# Altium project BMS Top Cell.PrjPcb
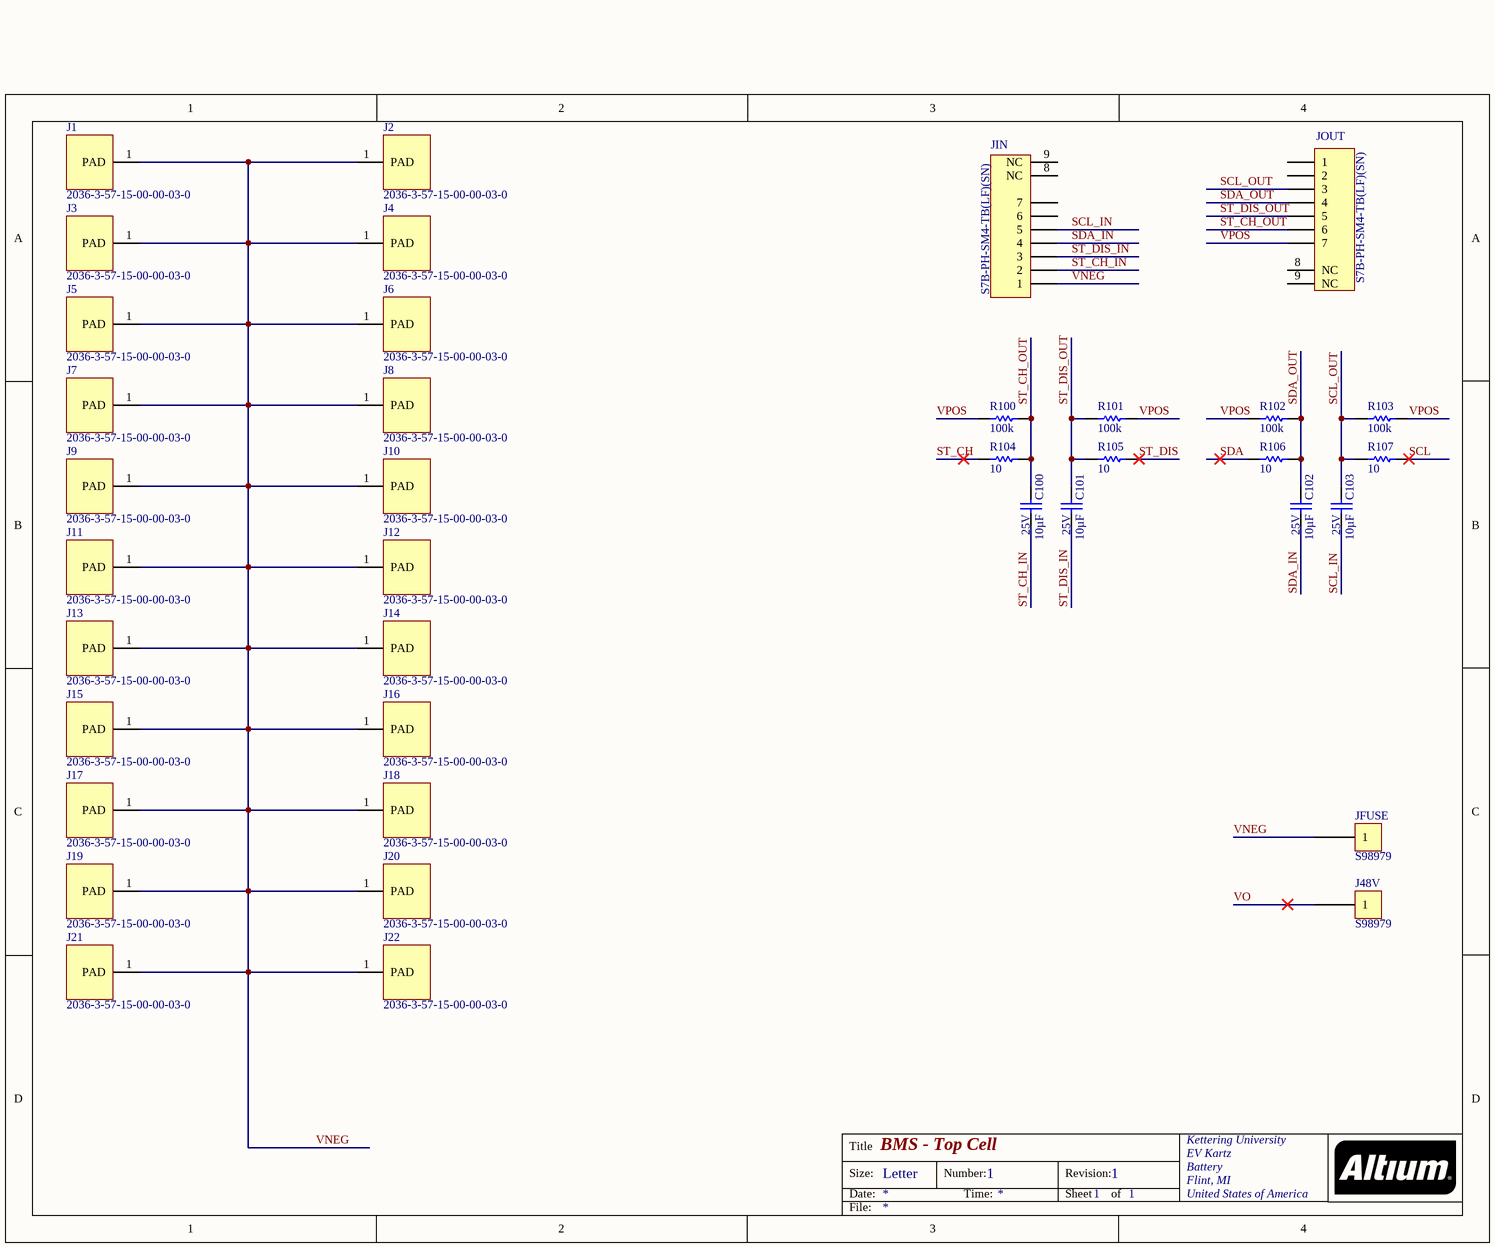
[diagram p0: Pg1 Top Sheet and Micro.SchDoc]
1 sheet, 38 parts. Net scope: global (net labels, ports and power ports of the same name join across sheets).
Board file: Top_Cell.PcbDoc

## Sheet Pg1 Top Sheet and Micro.SchDoc: BMS - Top Cell
size Letter; Organization: Kettering University; Address1: EV Kartz; Address2: Battery; Address3: Flint, MI; Address4: United States of America; DocumentNumber: 1; Revision: 1; SheetNumber: 1; SheetTotal: 1

### Parts
C100  value 10µF  Rated: 25V  [CAPC3225N]  (hidden comment: C1210C106K3RACAUTO)
C101  value 10µF  Rated: 25V  [CAPC3225N]  (hidden comment: C1210C106K3RACAUTO)
C102  value 10µF  Rated: 25V  [CAPC3225N]  (hidden comment: C1210C106K3RACAUTO)
C103  value 10µF  Rated: 25V  [CAPC3225N]  (hidden comment: C1210C106K3RACAUTO)
J1  2036-3-57-15-00-00-03-0  [6mm Pad]
J2  2036-3-57-15-00-00-03-0  [6mm Pad]
J3  2036-3-57-15-00-00-03-0  [6mm Pad]
J4  2036-3-57-15-00-00-03-0  [6mm Pad]
J5  2036-3-57-15-00-00-03-0  [6mm Pad]
J6  2036-3-57-15-00-00-03-0  [6mm Pad]
J7  2036-3-57-15-00-00-03-0  [6mm Pad]
J8  2036-3-57-15-00-00-03-0  [6mm Pad]
J9  2036-3-57-15-00-00-03-0  [6mm Pad]
J10  2036-3-57-15-00-00-03-0  [6mm Pad]
J11  2036-3-57-15-00-00-03-0  [6mm Pad]
J12  2036-3-57-15-00-00-03-0  [6mm Pad]
J13  2036-3-57-15-00-00-03-0  [6mm Pad]
J14  2036-3-57-15-00-00-03-0  [6mm Pad]
J15  2036-3-57-15-00-00-03-0  [6mm Pad]
J16  2036-3-57-15-00-00-03-0  [6mm Pad]
J17  2036-3-57-15-00-00-03-0  [6mm Pad]
J18  2036-3-57-15-00-00-03-0  [6mm Pad]
J19  2036-3-57-15-00-00-03-0  [6mm Pad]
J20  2036-3-57-15-00-00-03-0  [6mm Pad]
J21  2036-3-57-15-00-00-03-0  [6mm Pad]
J22  2036-3-57-15-00-00-03-0  [6mm Pad]
J48V  S98979  [S98979]
JFUSE  S98979  [S98979]
JIN  S7B-PH-SM4-TB(LF)(SN)  [JST-PH-S7]
JOUT  S7B-PH-SM4-TB(LF)(SN)  [JST-PH-S7]
R100  value 100k  [RESC2012N]  (hidden comment: ERJ-6ENF1003V)
R101  value 100k  [RESC2012N]  (hidden comment: ERJ-6ENF1003V)
R102  value 100k  [RESC2012N]  (hidden comment: ERJ-6ENF1003V)
R103  value 100k  [RESC2012N]  (hidden comment: ERJ-6ENF1003V)
R104  value 10  [RESC2012N]  (hidden comment: ERJ-6ENF10R0V)
R105  value 10  [RESC2012N]  (hidden comment: ERJ-6ENF10R0V)
R106  value 10  [RESC2012N]  (hidden comment: ERJ-6ENF10R0V)
R107  value 10  [RESC2012N]  (hidden comment: ERJ-6ENF10R0V)

### Nets
SCL: R107.2
SCL_IN: C103.1 JIN.5
SCL_OUT: C103.2 JOUT.3 R103.2 R107.1
SDA: R106.1
SDA_IN: C102.1 JIN.4
SDA_OUT: C102.2 JOUT.4 R102.1 R106.2
ST_CH: R104.1
ST_CH_IN: C100.1 JIN.2
ST_CH_OUT: C100.2 JOUT.6 R100.1 R104.2
ST_DIS: R105.2
ST_DIS_IN: C101.1 JIN.3
ST_DIS_OUT: C101.2 JOUT.5 R101.2 R105.1
VNEG: J1.1(PAD) J2.1(PAD) J3.1(PAD) J4.1(PAD) J5.1(PAD) J6.1(PAD) J7.1(PAD) J8.1(PAD) J9.1(PAD) J10.1(PAD) J11.1(PAD) J12.1(PAD) J13.1(PAD) J14.1(PAD) J15.1(PAD) J16.1(PAD) J17.1(PAD) J18.1(PAD) J19.1(PAD) J20.1(PAD) J21.1(PAD) J22.1(PAD) JFUSE.1 JIN.1
VO: J48V.1
VPOS: JOUT.7 R100.2 R101.1 R102.2 R103.1

Not connected (* = marked no-connect by the designer): JIN 6 7 8(NC) 9(NC); JOUT 1 2 8(NC) 9(NC)

### Notes on the sheet
- Title
- Size:
- Date:
- Letter
- Number:
- Time:
- Revision:
- Sheet
- of
- File:

### Library data of the parts
C100-C103 = C1210C106K3RACAUTO: Capacitor, Ceramic, 10µF, 25V, 0805, 10%, 125C; Supplier 1: Digi-Key; Supplier Part Number 1: 399-7046-1-ND; Category: C; Tol: 10%; Temp: 125C
J1-J22 = 2036-3-57-15-00-00-03-0: Hardware, Sprint Contact Surface; Supplier 1: Digi-Key; Supplier Part Number 1: 54-2036-3-57-15-00-00-03-0CT-ND
J48V JFUSE = S98979: Screw Terminal M8, 360A; Supplier 1: Digi-Key; Supplier Part Number 1: 2101-S98979-ND
JIN JOUT = S7B-PH-SM4-TB(LF)(SN): Header, JST, 7-Pin, Right-Angle, PH, Surface Mount; Category: J; Supplier 1: Digi-Key; Supplier Part Number 1: 455-1754-1-ND
R100-R103 = ERJ-6ENF1003V: Resistor, Fixed, 100 kOhm, 0805, 1%, 1/8W; Supplier 1: Digi-Key; Supplier Part Number 1: P100KCCT-ND; Rated: 1/8W; Tol: 1%; Category: R
R104-R107 = ERJ-6ENF10R0V: Resistor, Fixed, 10 Ohm, 0805, 1%, 1/8W; Supplier 1: Digi-Key; Supplier Part Number 1: P10.0CCT-ND; Rated: 1/8W; Tol: 1%; Category: R